# Altium schematic sheet Top.SchDoc
size A
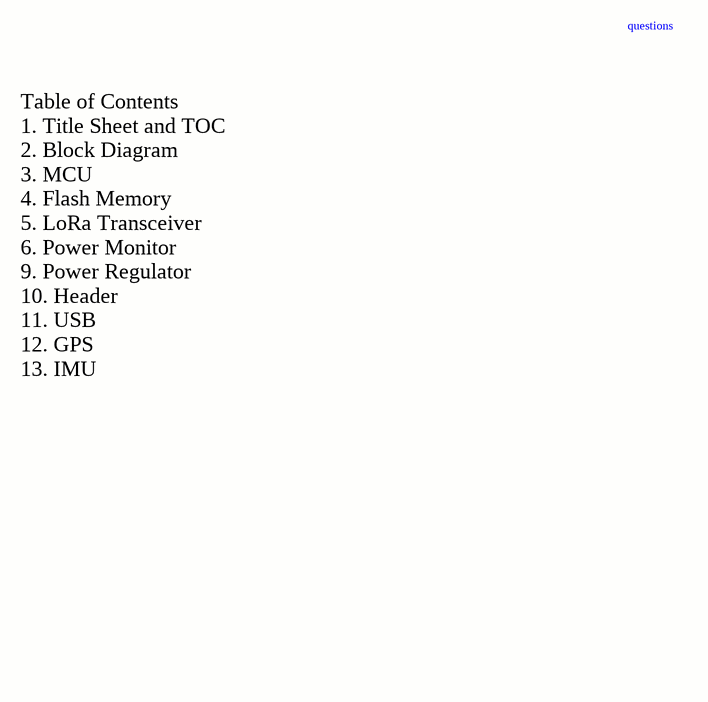
[diagram p0: Top.SchDoc]

## Notes on the sheet
- questions
- Table of Contents
  1. Title Sheet and TOC
  2. Block Diagram
  3. MCU
  4. Flash Memory
  5. LoRa Transceiver
  6. Power Monitor
  9. Power Regulator
  10. Header
  11. USB
  12. GPS
  13. IMU